# EasyEDA Pro project smart-switch-v100.eprj, schematic base-board-20A
Board Name: base-board; Create Date: 2025-08-31; Page Name: P1; Project Name: smart-switch-v2; Schematic Name: base-board-20A; Update Date: 2025-11-08; Company: EasyEDA.com; Page Size: A4; Version: V1.0
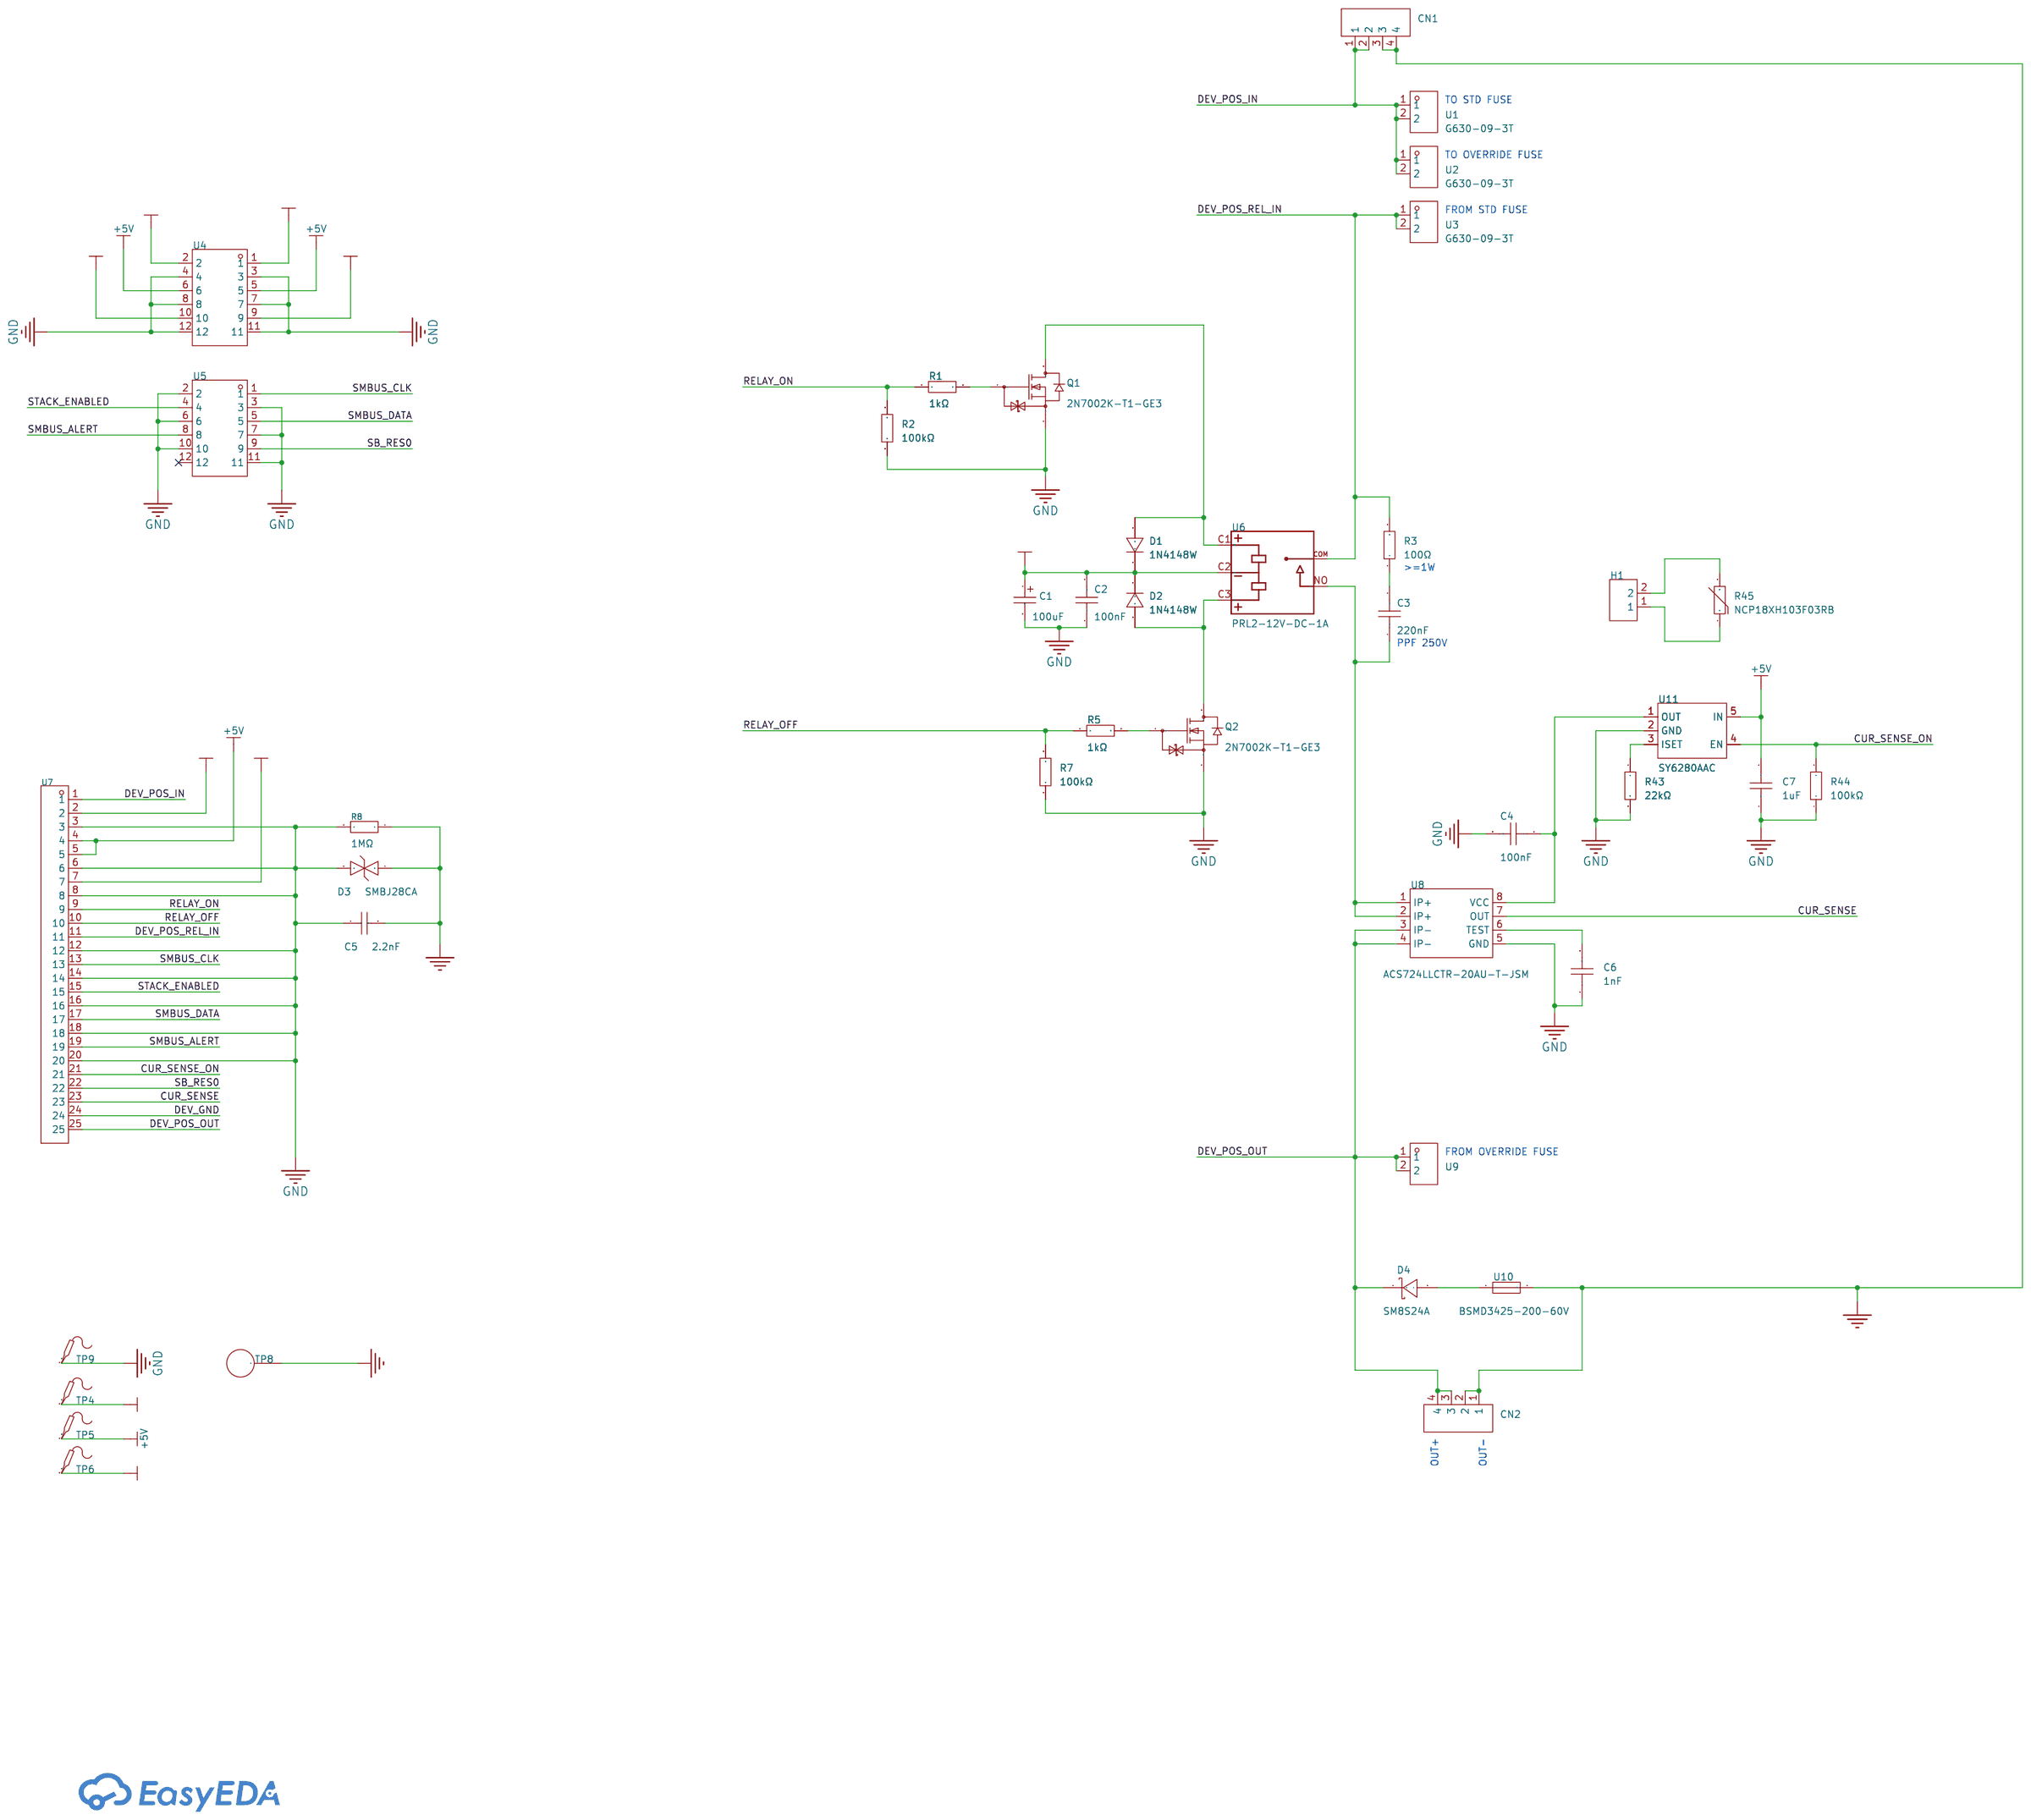
[diagram p1: schematic sheet]

## Parts
C1  100uF  [CAP-SMD_BD6.3-L6.6-W6.6-LS7.6-RD]
C2  100nF  [C0603]
C3  220nF  [C1812]
C4  100nF  [C0603]
C5  2.2nF  [C1206]
C6  1nF  [C0603]
C7  1uF  [C0603]
CN1  WJ128V-5.0-4P  [CONN-TH_4P-P5.00_WJ128V-4P-5.0-14-00A]
CN2  WJ128V-5.0-4P  [CONN-TH_4P-P5.00_WJ128V-4P-5.0-14-00A]
D1  1N4148W  [SOD-123_L2.8-W1.8-LS3.7-RD]
D2  1N4148W  [SOD-123_L2.8-W1.8-LS3.7-RD]
D3  SMBJ28CA  [SMB_L4.6-W3.6-LS5.3-BI]
D4  SM8S24A  [DO-218AB_L13.5-W8.4-LS15.5-FD]
H1  PZ254V-11-02P  [HDR-TH_2P-P2.54-V-M]
Q1  2N7002K-T1-GE3  [SOT-23-3_L2.9-W1.6-P1.90-LS2.8-BR]
Q2  2N7002K-T1-GE3  [SOT-23-3_L2.9-W1.6-P1.90-LS2.8-BR]
R1  1kΩ  [R0603]
R2  100kΩ  [R0603]
R3  100Ω  [R2512]
R5  1kΩ  [R0603]
R7  100kΩ  [R0603]
R8  1MΩ  [R1206]
R43  22kΩ  [R0603]
R44  100kΩ  [R0603]
R45  NCP18XH103F03RB  [R0603]
TP4  -  [Test-Point-0.5mm]
TP5  -  [Test-Point-0.5mm]
TP6  -  [Test-Point-0.5mm]
TP8  RH-5004  [TESTPOINT_TH_BD2.5-D1.2]
TP9  -  [Test-Point-0.5mm]
U1  G630-09-3T  [CONN-TH_2P-L8.2-W0.8-P5.10]
U2  G630-09-3T  [CONN-TH_2P-L8.2-W0.8-P5.10]
U3  G630-09-3T  [CONN-TH_2P-L8.2-W0.8-P5.10]
U4  2005FV-2x6P  [HDR-TH_12P-P2.00-V-F-R2-C6-S2.00]
U5  2005FV-2x6P  [HDR-TH_12P-P2.00-V-F-R2-C6-S2.00]
U6  PRL2-12V-DC-1A  [RELAY_PRL2-5V-DC-1A]
U7  DW200R-11-25-43  [HDR-TH_25P-P2.00-V-F-1]
U8  ACS724LLCTR-20AU-T-JSM  [SOP-8_L4.9-W3.9-P1.27-LS6.0-BL]
U9  G630-09-3T  [CONN-TH_2P-L8.2-W0.8-P5.10]
U10  BSMD3425-200-60V  [FUSE-SMD_L8.6-W6.4]
U11  SY6280AAC  [SOT-23-5_L3.0-W1.7-P0.95-LS2.8-BL]

## Library data of the parts
C1 = RVT1H101M0607: Capacitance: Tolerance:±20% Tolerance:±20% Voltage Rating: Ripple Current:229mA@120Hz Diameter: Height - Seated (Max): Lifetime: Operating Temperature:-40℃~+105℃ Operating Temperature:-40℃~+105℃; LCSC Part Name: 100uF ±20% 50V; Supplier Part: C3151829; Manufacturer: ROQANG(容强); Supplier Footprint: SMD,D6.3xL7.7mm; JLCPCB Part Class: Extended Part; Datasheet: https://atta.szlcsc.com/upload/public/pdf/source/20170325/1490427950282.pdf; Supplier: LCSC; Tolerance: ±20%; Ripple Current: 229mA@120Hz; Operating Temperature: -40℃~+105℃
C2 C4 = CC0603KRX7R9BB104: Capacitance:100nF Tolerance:±10% Tolerance:±10% Voltage Rating:50V Temperature Coefficient:X7R; LCSC Part Name: 100nF ±10% 50V; Supplier Part: C14663; Manufacturer: YAGEO(国巨); Supplier Footprint: 0603; JLCPCB Part Class: Basic Part; Datasheet: https://item.szlcsc.com/datasheet/CC0603KRX7R9BB104/15331.html; Supplier: LCSC; Tolerance: ±10%; Voltage Rating: 50V; Temperature Coefficient: X7R
C3 = FM43X224K251EFG: LCSC Part Name: 220nF ±10% 250V; Supplier Part: C146179; Manufacturer: PSA(信昌电陶); Supplier Footprint: 1812; JLCPCB Part Class: Extended Part; Datasheet: https://item.szlcsc.com/datasheet/FM43X224K251EFG/157511.html; Supplier: LCSC; Tolerance: ±10%; Voltage Rating: 250V; Temperature Coefficient: X7R
C5 = 1206B222K102NT: LCSC Part Name: 2.2nF ±10% 1kV; Supplier Part: C9191; Manufacturer: FH(风华); Supplier Footprint: 1206; JLCPCB Part Class: Extended Part; Datasheet: https://item.szlcsc.com/datasheet/1206B222K102NT/9716.html; Supplier: LCSC; Tolerance: ±10%; Voltage Rating: 1kV; Temperature Coefficient: X7R
C6 = CL10B102KB8NNNC: Capacitance:1nF Tolerance:±10% Tolerance:±10% Voltage Rating:50V Temperature Coefficient:X7R; LCSC Part Name: 1nF ±10% 50V; Supplier Part: C1588; Manufacturer: SAMSUNG(三星); Supplier Footprint: 0603; JLCPCB Part Class: Basic Part; Datasheet: https://item.szlcsc.com/datasheet/CL10B102KB8NNNC/1940.html; Supplier: LCSC; Tolerance: ±10%; Voltage Rating: 50V; Temperature Coefficient: X7R
C7 = CL10A105KB8NNNC: LCSC Part Name: 1uF ±10% 50V; Supplier Part: C15849; Manufacturer: SAMSUNG(三星); Supplier Footprint: 0603; JLCPCB Part Class: Basic Part; Datasheet: https://item.szlcsc.com/datasheet/CL10A105KB8NNNC/16531.html; Supplier: LCSC; Tolerance: ±10%; Voltage Rating: 50V; Temperature Coefficient: X5R
CN1 CN2 = WJ128V-5.0-4P: LCSC Part Name: 5mm 1x4P 排数:1 每排P数:4 直插; Supplier Part: C192769; Manufacturer: KANGNEX(康奈克斯电气); Supplier Footprint: 插件,P=5mm; JLCPCB Part Class: Extended Part; Datasheet: https://item.szlcsc.com/datasheet/WJ128V-5.0-4P/225152.html; Supplier: LCSC; Number of Positions or Pins: 1x4P; Pitch: 5mm; Color: Green; Mounting Type: Through Hole; Number of Pins: 4P; Number of Rows: 1; Number of PINs Per Row: 4; Current Rating: 20A; Voltage Rating (Max): 250V; Wire Gauge - AWG: 12~22; Wire Gauge - mm2: 2.5; Operating Temperature: -40℃~+105℃
D1 D2 = 1N4148W_C2099: LCSC Part Name: 丝印T4 1N4148W; Supplier Part: C2099; Manufacturer: CJ(江苏长电/长晶); Supplier Footprint: SOD-123; JLCPCB Part Class: Extended Part; Datasheet: https://item.szlcsc.com/datasheet/1N4148W/2456.html; Supplier: LCSC; Diode Configuration: Independent; Voltage - Forward(Vf@If): 1.25V@150mA; Voltage - DC Reverse(Vr): 100V; Current - Rectified: 150mA; Pd - Power Dissipation: 500mW; Reverse Leakage Current (Ir): 1uA@75V; Reverse Recovery Time (trr): 4ns; Non-Repetitive Peak Forward Surge Current: 2A
D3 = SMBJ28CA_C726872: LCSC Part Name: 双向TVS 28V截止 峰值浪涌电流：13.3A@10/1000us; Supplier Part: C726872; Manufacturer: TWGMC(迪嘉); Supplier Footprint: DO-214AA(SMB); JLCPCB Part Class: Extended Part; Datasheet: https://item.szlcsc.com/datasheet/SMBJ28CA/773977.html; Supplier: LCSC; Polarity: Bidirectional; Reverse Stand-Off Voltage (Vrwm): 28V; Clamping Voltage: 45.4V; Peak Pulse Current (Ipp): 13.3A@10/1000us; Peak Pulse Power Dissipation (Ppp): 600W@10/1000us; Voltage - Breakdown: 34.4V; Reverse Leakage Current (Ir): 1uA; Operating Temperature: -65℃~+150℃; Type: TVS; Junction Capacitance: 390pF
D4 = SM8S24A_C314439: LCSC Part Name: 单向TVS 24V截止 170A峰值脉冲; Supplier Part: C314439; Manufacturer: DOWO(东沃); Supplier Footprint: DO-218AB; JLCPCB Part Class: Extended Part; Datasheet: https://item.szlcsc.com/datasheet/SM8S24A/296826.html; Supplier: LCSC; Polarity: Unidirectional; Reverse Stand-Off Voltage (Vrwm): 24V; Clamping Voltage: 38.9V; Peak Pulse Current (Ipp): 170A; Peak Pulse Power Dissipation (Ppp): 6.6kW@10/1000us; Voltage - Breakdown: 26.7V; Reverse Leakage Current (Ir): 10uA; Operating Temperature: -55℃~+175℃; Type: TVS
H1 = PZ254V-11-02P: LCSC Part Name: 1x2P 间距:2.54mm 方针 直插; Supplier Part: C492401; Manufacturer: XFCN(兴飞); Supplier Footprint: 插件,P=2.54mm; JLCPCB Part Class: Extended Part; Datasheet: https://item.szlcsc.com/datasheet/PZ254V-11-02P/502957.html; Supplier: LCSC; Pin Structure: 1x2P; Pitch: 2.54mm; Circluar Pins/Square Pins: Pin Header; Mounting Type: Through Hole; Number of Rows: 1; Number of Pins: 2P; Length of Mating Pin: 6mm; Insulation Height: 2.5mm; Length of End Connection Pin: 3mm; Contact Material: Brass; Operating Temperature: -40℃~+105℃; Color: Black
Q1 Q2 = 2N7002K-T1-GE3: LCSC Part Name: 1个N沟道 耐压:60V 电流:300mA; Supplier Part: C81445; Manufacturer: VISHAY(威世); Supplier Footprint: SOT-23; JLCPCB Part Class: Extended Part; Datasheet: https://item.szlcsc.com/datasheet/2N7002K-T1-GE3/82596.html; Supplier: LCSC; Number: 1 N-Channel; Drain to Source Voltage: 60V; Current - Continuous Drain(Id): 300mA; RDS(on): 2Ω@10V,500mA; Pd - Power Dissipation: 350mW; Gate Threshold Voltage (Vgs(th)): 2.5V; Gate Charge(Qg): 600pC@10V; Reverse Transfer Capacitance (Crss@Vds): 2.5pF@10V; Operating Temperature: -55℃~+150℃
R1 R5 = 0603WAF1001T5E: Type:Thick Film Resistors Resistance:1kΩ Tolerance:±1% Tolerance:±1% Power(Watts): Overload Voltage (Max): Temperature Coefficient:±100ppm/℃ Temperature Coefficient:±100ppm/℃ Operating Temperature Range:-55℃~+155℃ Operating Temperature Range:-55℃~+155℃; LCSC Part Name: 1kΩ ±1% 100mW 厚膜电阻; Supplier Part: C21190; Manufacturer: UNI-ROYAL(厚声); Supplier Footprint: 0603; JLCPCB Part Class: Basic Part; Datasheet: https://atta.szlcsc.com/upload/public/pdf/source/20200306/C422600_1E6D84923E4A46A82E41ADD87F860B5C.pdf; Supplier: LCSC; Type: Thick Film Resistors; Tolerance: ±1%; Temperature Coefficient: ±100ppm/℃; Operating Temperature Range: -55℃~+155℃
R2 R7 R44 = 0603WAF1003T5E: Type:Thick Film Resistor Resistance:100kΩ Tolerance:±1% Tolerance:±1% Power(Watts):100mW Voltage-Supply(Max):75V Temperature Coefficient:±100ppm/℃ Temperature Coefficient:±100ppm/℃ Operating Temperature:-55℃~+155℃ Operating Temperature:-55℃~+155℃; LCSC Part Name: 100kΩ ±1% 100mW 厚膜电阻; Supplier Part: C25803; Manufacturer: UNI-ROYAL(厚声); Supplier Footprint: 0603; JLCPCB Part Class: Basic Part; Datasheet: https://item.szlcsc.com/datasheet/0603WAF1003T5E/26546.html; Supplier: LCSC; Type: Thick Film Resistor; Tolerance: ±1%; Power(Watts): 100mW; Voltage-Supply(Max): 75V; Temperature Coefficient: ±100ppm/℃; Operating Temperature: -55℃~+155℃
R3 = FRP2512F1000TS: Type:Thick Film Resistor Resistance:100Ω Tolerance:±1% Tolerance:±1% Power(Watts):2W Voltage-Supply(Max):200V Temperature Coefficient:±200ppm/℃ Temperature Coefficient:±200ppm/℃ Operating Temperature:-55℃~+155℃ Operating Temperature:-55℃~+155℃; LCSC Part Name: 100Ω ±1% 2W 厚膜电阻; Supplier Part: C5126189; Manufacturer: FOJAN(富捷); Supplier Footprint: 2512; JLCPCB Part Class: Extended Part; Supplier: LCSC; Type: Thick Film Resistor; Tolerance: ±1%; Power(Watts): 2W; Voltage-Supply(Max): 200V; Temperature Coefficient: ±200ppm/℃; Operating Temperature: -55℃~+155℃
R8 = 1206W4F1004T5E: LCSC Part Name: 1MΩ ±1% 250mW 厚膜电阻; Supplier Part: C17927; Manufacturer: UNI-ROYAL(厚声); Supplier Footprint: 1206; JLCPCB Part Class: Basic Part; Datasheet: https://item.szlcsc.com/datasheet/1206W4F1004T5E/18615.html; Supplier: LCSC; Type: Thick Film Resistor; Tolerance: ±1%; Power(Watts): 250mW; Voltage-Supply(Max): 200V; Temperature Coefficient: ±100ppm/℃; Operating Temperature: -55℃~+155℃
R43 = 0603WAF2202T5E: Type:Thick Film Resistors Resistance:22kΩ Tolerance:±1% Tolerance:±1% Power(Watts): Overload Voltage (Max): Temperature Coefficient:±100ppm/℃ Temperature Coefficient:±100ppm/℃ Operating Temperature Range:-55℃~+155℃ Operating Temperature Range:-55℃~+155℃; LCSC Part Name: 22kΩ ±1% 100mW 厚膜电阻; Supplier Part: C31850; Manufacturer: UNI-ROYAL(厚声); Supplier Footprint: 0603; JLCPCB Part Class: Basic Part; Datasheet: https://atta.szlcsc.com/upload/public/pdf/source/20200306/C422600_1E6D84923E4A46A82E41ADD87F860B5C.pdf; Supplier: LCSC; Type: Thick Film Resistors; Tolerance: ±1%; Temperature Coefficient: ±100ppm/℃; Operating Temperature Range: -55℃~+155℃
R45 = NCP18XH103F03RB: Supplier Part: C13564; Manufacturer: muRata(村田); Supplier Footprint: 0603; JLCPCB Part Class: Extended Part; Datasheet: https://item.szlcsc.com/datasheet/NCP18XH103F03RB/14214.html; Supplier: LCSC; Resistance @ 25℃: 10kΩ; B Constant (25℃/50℃): 3380K; B Constant (25℃/85℃): 3434K; B Constant (25℃/100℃): 3455K; Power(Watts): 100mW; B Constant Tolerance: ±1%; Steady State Current (Max): 310uA; Operating Temperature: -40℃~+125℃
TP4-TP6 TP9 = Test-Point
TP8 = RH-5004: Connector Type:Pin type (through board) Plastic Color:Yellow Board Space (Diameter φ/ Length x Width):2.5mm; LCSC Part Name: PCB电路板测试点/测试针; Supplier Part: C5199804; Manufacturer: 荣和; JLCPCB Part Class: Extended Part; Supplier: LCSC; Connector Type: Pin type (through board); Plastic Color: Yellow; Board Space (Diameter φ/ Length x Width): 2.5mm
U1-U3 U9 = G630-09-3T: LCSC Part Name: 6.3mmPCB焊接端子-插片; Supplier Part: C27636945; Manufacturer: SAMZO(三佐); Supplier Footprint: 插件; JLCPCB Part Class: Extended Part; Datasheet: https://item.szlcsc.com/datasheet/G630-09-3T/29374908.html; Supplier: LCSC
U4 U5 = 2005FV-2x6P: LCSC Part Name: 间距:2mm 2x6P 直插; Supplier Part: C18723068; Manufacturer: HanElectricity(瀚源); Supplier Footprint: 插件,P=2mm; JLCPCB Part Class: Extended Part; Datasheet: https://item.szlcsc.com/datasheet/2005FV-2x6P/19915672.html; Supplier: LCSC; Holes Structure: 2x6P; Pitch: 2mm; Row Spacing: 2mm; Circular Hole / Square Hole: Square Hole; Mounting Type: Through Hole; Number of Rows: 2; Number of Positions: 12P; Current Rating: 2A; Holes Direction: Top; Insulation Height: 4.3mm; Operating Temperature: -40℃~+105℃
U6 = PRL2-12V-DC-1A: Height: 16.4mm
U7 = DW200R-11-25-43: LCSC Part Name: 1x25P 间距:2mm 直插; Supplier Part: C7506696; Manufacturer: DEALON(德艺隆); Supplier Footprint: 插件,P=2mm; Datasheet: https://item.szlcsc.com/datasheet/DW200R-11-25-43/8597336.html; Supplier: LCSC; Holes Structure: 1x25P; Pitch: 2mm; Mounting Type: Through Hole; Number of Rows: 1
U8 = ACS724LLCTR-20AU-T-JSM: Supplier Part: C46596282; Manufacturer: JSMSEMI(杰盛微); Supplier Footprint: SOP-8; JLCPCB Part Class: Extended Part; Datasheet: https://item.szlcsc.com/datasheet/ACS724LLCTR-20AU-T-JSM/48736594.html; Supplier: LCSC
U10 = BSMD3425-200-60V: LCSC Part Name: 3425 2A 60V 佰宏高电压; Supplier Part: C22470012; Manufacturer: BHFUSE(佰宏); Supplier Footprint: 3425; JLCPCB Part Class: Extended Part; Datasheet: https://item.szlcsc.com/datasheet/BSMD3425-200-60V/24184389.html; Supplier: LCSC; Voltage - Max: 60V; Current - Max: 20A; Hold Current: 2A; Trip Current: 4A; Power Dissipation: 2.5W; Resistance - Initial (Ri) (Min): 40mΩ; Resistance - Post Trip (R1) (Max): 200mΩ; Time to Trip(Max): 8s; Operating Temperature: -40℃~+85℃; Length: 9mm; Width: 6.7mm; Height: 2mm
U11 = SY6280AAC_C55136: Supplier Part: C55136; Manufacturer: Silergy(矽力杰); Supplier Footprint: SOT-23-5; JLCPCB Part Class: Extended Part; Datasheet: https://item.szlcsc.com/datasheet/SY6280AAC/56162.html; Supplier: LCSC; Type: High Side Switch; Number of Channels: 1; Control Input Logic: Active High; Voltage - Supply: 2.4V~5.5V; RDS(on): 80mΩ; Operating Temperature	-: -40℃~+125℃; Features: Over Temperature Protection；Overcurrent Protection(OCP)

## Nets
+3V3: TP6.1 U4.9 U4.10 U7.7
+5V: C7.2 TP5.1 U4.5 U4.6 U7.4 U7.5 U11.5(IN)
+12V: C1.1 C2.2 D1.1(K) D2.1(K) TP4.1 U4.1 U4.2 U6.C2(COIL2) U7.2
GND: C1.2 C2.1 C4.2 C5.1 C6.1 C7.1 D3.2 Q1.2(S) Q2.2(S) R2.1 R7.1 R8.2 R43.2 R44.1 TP9.1 U4.3 U4.4 U4.7 U4.8 U4.11 U4.12 U5.2 U5.3 U5.6 U5.7 U5.10 U5.11 U7.3 U7.6 U7.8 U7.12 U7.14 U7.16 U7.18 U7.20 U8.5(GND) U11.2(GND)
CUR_SENSE: U7.23 U8.7(OUT)
CUR_SENSE_ON: R44.2 U7.21 U11.4(EN)
DEV_GND: C5.2 CN1.3 CN1.4 CN2.1 CN2.2 D3.1 R8.1 TP8.1 U7.24 U10.2
DEV_POS_IN: CN1.1 CN1.2 U1.1 U1.2 U2.1 U2.2 U7.1
DEV_POS_OUT: CN2.3 CN2.4 D4.1(K) U7.25 U8.3(IP-) U8.4(IP-) U9.1 U9.2
DEV_POS_REL_IN: R3.2 U3.1 U3.2 U6.COM U7.11
RELAY_OFF: R5.1 R7.2 U7.10
RELAY_ON: R1.1 R2.2 U7.9
SB_RES0: U5.9 U7.22
SMBUS_ALERT: U5.8 U7.19
SMBUS_CLK: U5.1 U7.13
SMBUS_DATA: U5.5 U7.17
STACK_ENABLED: U5.4 U7.15
$1N23159: Q1.1(G) R1.2
$1N23163: Q2.1(G) R5.2
$1N23164: D1.2(A) Q1.3(D) U6.C1(COIL1)
$1N23167: C3.2 R3.1
$1N23168: C3.1 U6.NO U8.1(IP+) U8.2(IP+)
$1N23707: C6.2 U8.6(TEST)
$1N23801: D2.2(A) Q2.3(D) U6.C3(COIL3)
$1N27997: D4.2(A) U10.1
$1N39427: C4.1 U8.8(VCC) U11.1(OUT)
$1N40878: R43.1 U11.3(ISET)
$1N41202: H1.2 R45.2
$1N41212: H1.1 R45.1

Not connected (* = marked no-connect by the designer): U5 12*

## Notes on the sheet
- TO STD FUSE
- TO OVERRIDE FUSE
- FROM STD FUSE
- >=1W
- PPF 250V
- FROM OVERRIDE FUSE
- OUT+
- OUT-
